# Altium schematic sheet Accelerometer.SchDoc
size A4
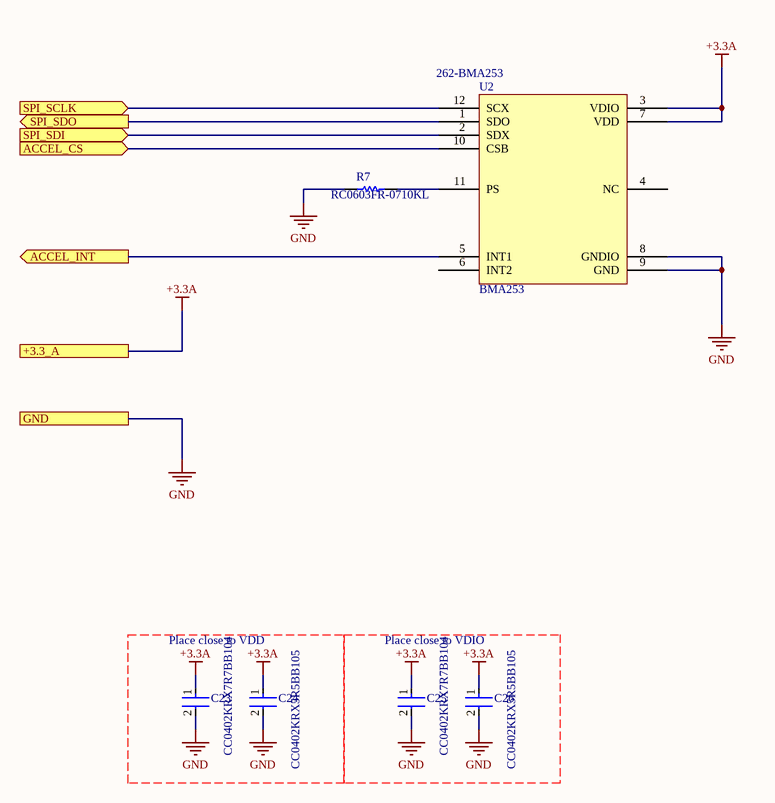
[diagram p0: Accelerometer.SchDoc]

## Parts
C23  CC0402KRX7R7BB104  [FP-CC0402-MFG]
C24  CC0402KRX5R5BB105  [FP-CC0402-MFG]
C25  CC0402KRX7R7BB104  [FP-CC0402-MFG]
C26  CC0402KRX5R5BB105  [FP-CC0402-MFG]
R7  RC0603FR-0710KL  [RESC1608X55X25ML10T15]
U2  BMA253  Supplier Part Number 1: 262-BMA253  [LGA12]

## Ports
+3.3_A, ACCEL_CS (in), ACCEL_INT (out), GND, SPI_SCLK (in), SPI_SDI (in), SPI_SDO (out)

## Nets
+3.3A: C23.1 C24.1 C25.1 C26.1 U2.3(VDIO) U2.7(VDD) ; port +3.3_A
GND: C23.2 C24.2 C25.2 C26.2 R7.2 U2.8(GNDIO) U2.9(GND) ; port GND
ACCEL_CS: U2.10(CSB) ; port ACCEL_CS
ACCEL_INT: U2.5(INT1) ; port ACCEL_INT
SPI_SCLK: U2.12(SCX) ; port SPI_SCLK
SPI_SDI: U2.2(SDX) ; port SPI_SDI
SPI_SDO: U2.1(SDO) ; port SPI_SDO
NetR7_1: R7.1 U2.11(PS)

Not connected (* = marked no-connect by the designer): U2 4(NC) 6(INT2)

## Notes on the sheet
- Place close to VDD
- Place close to VDIO

## Library data of the parts
C23 C25 = CMP-03422-000048-1: CAP CER 0.1UF 16V X7R 0402; Manufacturer: YAGEO; Material: Ceramic; Automotive Grade: NA; Capacitance: 100 nF; Temperature Coefficient: 30ppm/°C; Tolerance: 0.1; Value: 100 nF; Device Class L1: Passive Components; Temperature Range Low: -55°C; Device Class L3: Ceramic Capacitors; Temperature Characteristic: X7R; Ipc Land Pattern Name: CAPC10050X50; Temperature Range High: +125°C; Voltage Rating: 16 V; Temperature: -55°C to +125°C; RoHS: TRUE; Automotive: No; Height: 0.55mm; Device Class L2: Capacitors; Digikey Description: CAP CER 0.1UF 16V X7R 0402; Package: CC0402; Footprint Url: http://www.yageo.com/exep/pages/download/literatures/UPY-C_GEN_24.pdf; ComponentLink2Description: Datasheet; Category: Cap; Lead Free: Yes; Octopart: https://octopart.com/cc0402krx7r7bb104-yageo-42244624; ComponentLink2URL: http://www.yageo.com/documents/recent/UPY-GP_NP0_16V-to-50V_16.pdf; Manufacturer Part Number: CC0402KRX7R7BB104; Mouser Description: 0402 0.1 uF 16 V ±10 % Tolerance X7R SMT Multilayer Ceramic Capacitor
C24 C26 = CMP-03422-000496-1: CAP CER 1UF 6.3V X5R 0402; Manufacturer: YAGEO; Automotive Grade: NA; Material: Ceramic; Tolerance: 0.1; Temperature Coefficient: 30ppm/°C; Voltage Rating: 6.3 V; Temperature Range Low: -55°C; Digikey Description: CAP CER 1UF 6.3V X5R 0402; Capacitance: 1 uF; Height: 0.55mm; Automotive: No; ComponentLink2URL: http://www.yageo.com/documents/recent/UPY-GP_NP0_16V-to-50V_16.pdf; Device Class L2: Capacitors; RoHS: TRUE; Temperature Range High: +125°C; Device Class L3: Ceramic Capacitors; Device Class L1: Passive Components; Temperature Characteristic: X5R; Package: CC0402; Octopart: https://octopart.com/cc0402krx5r5bb105-yageo-42244618; ComponentLink2Description: Datasheet; Temperature: -55°C to +125°C; Manufacturer Part Number: CC0402KRX5R5BB105; Mouser Description: Multilayer Ceramic Capacitors MLCC - SMD/SMT 1uF 6.3V X5R 10%; Category: Cap; Footprint Url: http://www.yageo.com/exep/pages/download/literatures/UPY-C_GEN_24.pdf; Lead Free: Yes; Ipc Land Pattern Name: CAPC10050X50; Value: 1 uF
R7 = CMP-2100-03664-1: Chip Resistor, 10 KOhm, +/- 1%, 01 W, -55 to 155 degC, 0603 (1608 Metric), RoHS, Tape and Reel; Manufacturer: Yageo; Temperature Coefficient: 100ppm/degreesC; Resistance: 10KOhm; Voltage Rating: 75V; Power Rating: 100mW; Voltage Rating (DC): 50V; Composition: ThickFilm; RoHSCompliant: true; Height: 0.45mm; Lead Free: LeadFree; Case Code (Metric): 1608; Case/Package: 0603; Datasheet Version: Rev. 5, 10/2016; Package Reference: 0603; Depth: 0.8mm; Package Description: 2-Pin Surface Mount Device, Body 1.6 x 0.8 mm; Case Code (Imperial): 0603; Packaging: TapeandReel; Termination: SMD/SMT; Lead Pitch: 0.3mm; Width: 0.8mm; Number of Pins: 2; Length: 1.6mm; REACH SVHC: NoSVHC; Military Standard: Not; Max Operating Temperature: 155degC; Min Operating Temperature: -55degC; Manufacturer URL: http://www.yageo.com/; Datasheet URL: http://www.yageo.com/NewPortal/yageodocoutput?fileName=/pdf/R-Chip/PYu-RC_Group_51_RoHS_L_5.pdf; Weight: 7.1E-05oz; Tolerance: 1%
U2 = BMA253: Supplier 1: Mouser